# Altium schematic sheet cgd_rif.schdoc
size A3; Organization: Develer s.r.l.; Address1: via Mugellese 1/A; Address2: 50019 Campi Bisenzio; Address3: Firenze; Address4: ITALY; Revision: A; SheetNumber: 1; SheetTotal: 1
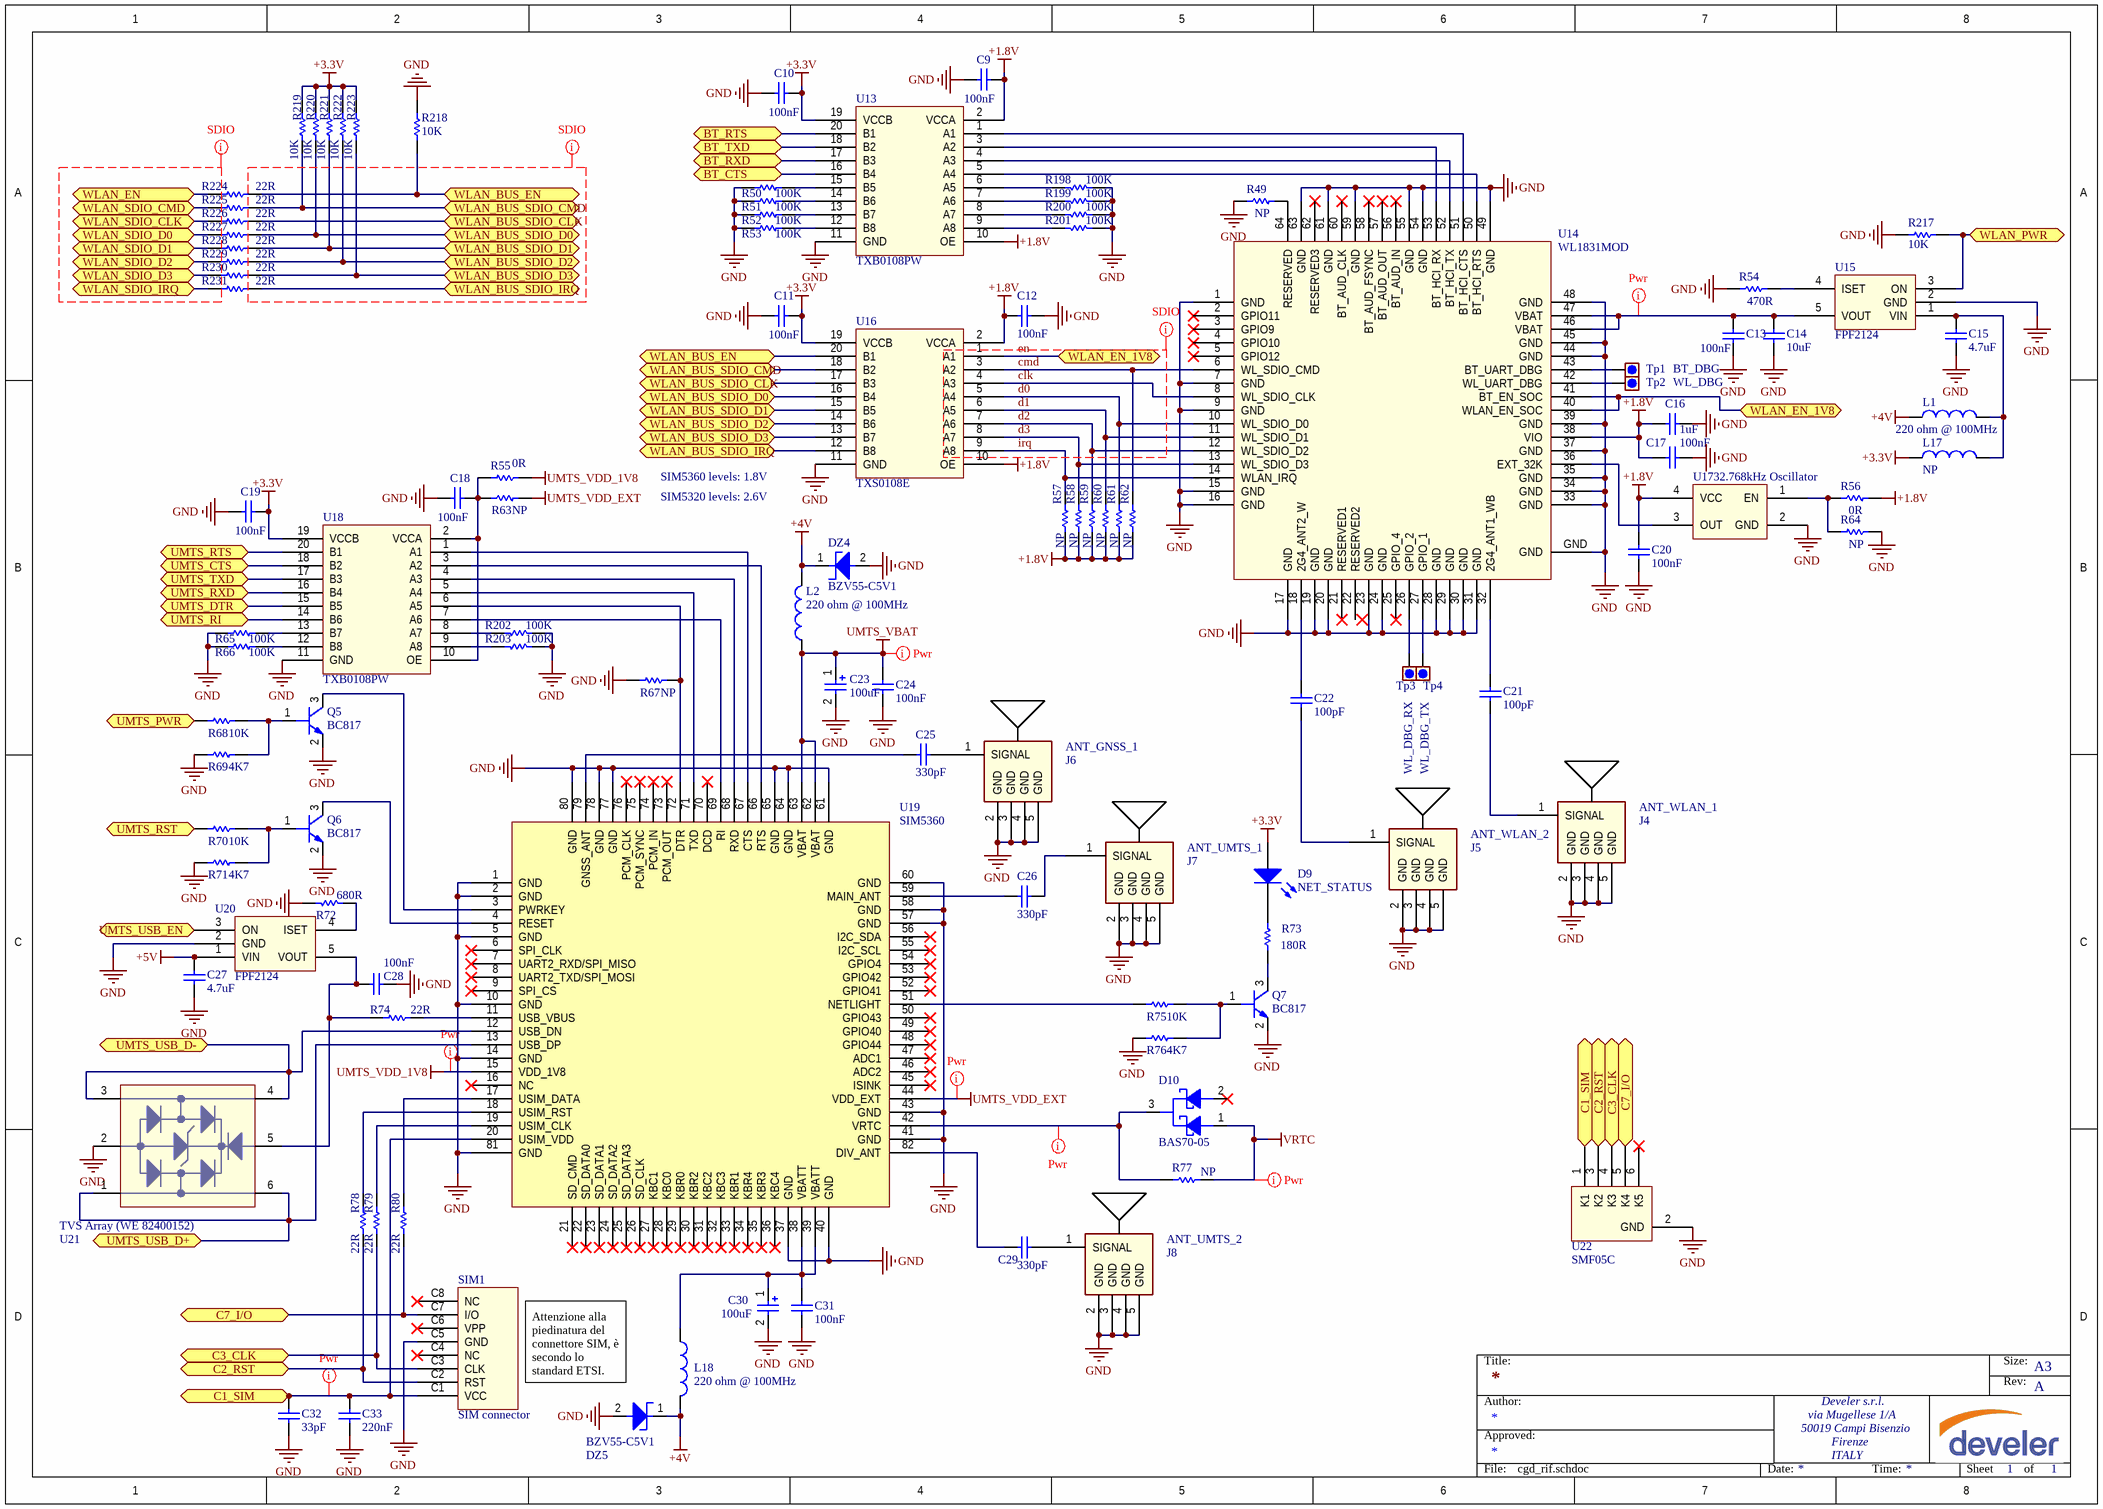
[diagram p0: cgd_rif.schdoc]

## Parts
C9  100nF  [0603_[1608]]
C10  100nF  [0603_[1608]]
C11  100nF  [0603_[1608]]
C12  100nF  [0603_[1608]]
C13  100nF  [0603_[1608]]
C14  10uF  [1206_[3216]]
C15  4.7uF  [0805_[2012]]
C16  1uF  [1206_[3216]]
C17  100nF  [0603_[1608]]
C18  100nF  [0603_[1608]]
C19  100nF  [0603_[1608]]
C20  100nF  [0603_[1608]]
C21  100pF  [0603_[1608]]
C22  100pF  [0603_[1608]]
C23  100uF  [CAP_6x6_D8_SMD]
C24  100nF  [0603_[1608]]
C25  330pF  [0603_[1608]]
C26  330pF  [0603_[1608]]
C27  4.7uF  [0805_[2012]]
C28  100nF  [0603_[1608]]
C29  330pF  [0603_[1608]]
C30  100uF  [CAP_6x6_D8_SMD]
C31  100nF  [0603_[1608]]
C32  33pF  [0603_[1608]]
C33  220nF  [0603_[1608]]
D9  NET_STATUS  [0603_[1608]_LED]
D10  BAS70-05  [SOT-23]
DZ4  BZV55-C5V1  [SOD-80C]
DZ5  BZV55-C5V1  [SOD-80C]
J4  ANT_WLAN_1  [MMCX_SMD_VERTICAL]
J5  ANT_WLAN_2  [MMCX_SMD_VERTICAL]
J6  ANT_GNSS_1  [MMCX_SMD_VERTICAL]
J7  ANT_UMTS_1  [MMCX_SMD_VERTICAL]
J8  ANT_UMTS_2  [MMCX_SMD_VERTICAL]
L1  220 ohm @ 100MHz  [0805_[2012]]
L2  220 ohm @ 100MHz  [0805_[2012]]
L17  NP  [0805_[2012]]
L18  220 ohm @ 100MHz  [0805_[2012]]
Q5  BC817  [SOT-23]
Q6  BC817  [SOT-23]
Q7  BC817  [SOT-23]
R49  NP  [0603_[1608]]
R50  100K  [0603_[1608]]
R51  100K  [0603_[1608]]
R52  100K  [0603_[1608]]
R53  100K  [0603_[1608]]
R54  470R  [0603_[1608]]
R55  0R  [0603_[1608]]
R56  0R  [0603_[1608]]
R57  NP  [0603_[1608]]
R58  NP  [0603_[1608]]
R59  NP  [0603_[1608]]
R60  NP  [0603_[1608]]
R61  NP  [0603_[1608]]
R62  NP  [0603_[1608]]
R63  NP  [0603_[1608]]
R64  NP  [0603_[1608]]
R65  100K  [0603_[1608]]
R66  100K  [0603_[1608]]
R67  NP  [0603_[1608]]
R68  10K  [0603_[1608]]
R69  4K7  [0603_[1608]]
R70  10K  [0603_[1608]]
R71  4K7  [0603_[1608]]
R72  680R  [0603_[1608]]
R73  180R  [0603_[1608]]
R74  22R  [0603_[1608]]
R75  10K  [0603_[1608]]
R76  4K7  [0603_[1608]]
R77  NP  [0603_[1608]]
R78  22R  [0603_[1608]]
R79  22R  [0603_[1608]]
R80  22R  [0603_[1608]]
R198  100K  [0603_[1608]]
R199  100K  [0603_[1608]]
R200  100K  [0603_[1608]]
R201  100K  [0603_[1608]]
R202  100K  [0603_[1608]]
R203  100K  [0603_[1608]]
R217  10K  [0603_[1608]]
R218  10K  [0603_[1608]]
R219  10K  [0603_[1608]]
R220  10K  [0603_[1608]]
R221  10K  [0603_[1608]]
R222  10K  [0603_[1608]]
R223  10K  [0603_[1608]]
R224  22R  [0603_[1608]]
R225  22R  [0603_[1608]]
R226  22R  [0603_[1608]]
R227  22R  [0603_[1608]]
R228  22R  [0603_[1608]]
R229  22R  [0603_[1608]]
R230  22R  [0603_[1608]]
R231  22R  [0603_[1608]]
SIM1  SIM connector  [sim_holder]
Tp1  BT_DBG  [TEST_POINT_THD_D1.6MM]  (no BOM)
Tp2  WL_DBG  [TEST_POINT_THD_D1.6MM]  (no BOM)
Tp3  WL_DBG_RX  [TEST_POINT_THD_D1.6MM]  (no BOM)
Tp4  WL_DBG_TX  [TEST_POINT_THD_D1.6MM]  (no BOM)
U13  TXB0108PW  [TSOP65P640X120-20L]
U14  WL1831MOD  [WL18XX_E-13.4X13.3-N100_0.75]
U15  FPF2124  [SOT-23-5]
U16  TXS0108E  [TSOP65P640X120-20L]
U17  32.768kHz Oscillator  [CRYSTAL_3.2X1.5MM_4P_SMD]
U18  TXB0108PW  [TSOP65P640X120-20L]
U19  SIM5360  [Sim5360]
U20  FPF2124  [SOT-23-5]
U21  TVS Array (WE 82400152)  [SOT-563]
U22  SMF05C  [SC70-6]

## Ports
BT_CTS, BT_RTS, BT_RXD, BT_TXD, C1_SIM, C2_RST, C3_CLK, C7_I/O, UMTS_CTS, UMTS_DTR, UMTS_PWR, UMTS_RI, UMTS_RST, UMTS_RTS, UMTS_RXD, UMTS_TXD, UMTS_USB_D+, UMTS_USB_D-, UMTS_USB_EN, WLAN_BUS_EN, WLAN_BUS_SDIO_CLK, WLAN_BUS_SDIO_CMD, WLAN_BUS_SDIO_D0, WLAN_BUS_SDIO_D1, WLAN_BUS_SDIO_D2, WLAN_BUS_SDIO_D3, WLAN_BUS_SDIO_IRQ, WLAN_EN, WLAN_EN_1V8, WLAN_PWR, WLAN_SDIO_CLK, WLAN_SDIO_CMD, WLAN_SDIO_D0, WLAN_SDIO_D1, WLAN_SDIO_D2, WLAN_SDIO_D3, WLAN_SDIO_IRQ

## Nets
+1.8V: C9.2 C12.2 C16.2 C17.2 C20.2 R56.1 R57.1 R58.1 R59.1 R60.1 R61.1 R62.1 U13.2(VCCA) U13.10(OE) U14.38(VIO) U16.2(VCCA) U16.10(OE) U17.4(VCC)
+3.3V: C10.2 C11.2 C19.2 D9.1(A) L17.2 R219.1 R220.1 R221.1 R222.1 R223.1 U13.19(VCCB) U16.19(VCCB) U18.19(VCCB)
+4V: DZ4.1 DZ5.1 L1.2 L2.1 L18.1
+5V: C27.2 U20.1(VIN)
GND: C9.1 C10.1 C11.1 C12.1 C13.1 C14.1 C15.1 C16.1 C17.1 C18.1 C19.1 C20.1 C23.2 C24.1 C27.1 C28.1 C30.2 C31.1 C32.1 C33.1 DZ4.2 DZ5.2 J4.2(GND) J4.3(GND) J4.4(GND) J4.5(GND) J5.2(GND) J5.3(GND) J5.4(GND) J5.5(GND) J6.2(GND) J6.3(GND) J6.4(GND) J6.5(GND) J7.2(GND) J7.3(GND) J7.4(GND) J7.5(GND) J8.2(GND) J8.3(GND) J8.4(GND) J8.5(GND) Q5.2(E) Q6.2(E) Q7.2(E) R49.2 R50.2 R51.2 R52.2 R53.2 R54.2 R64.1 R65.2 R66.2 R67.2 R69.2 R71.2 R72.2 R76.2 R198.2 R199.2 R200.2 R201.2 R202.2 R203.2 R217.1 R218.1 SIM1.C5(GND) U13.11(GND) U14.1(GND) U14.7(GND) U14.9(GND) U14.15(GND) U14.16(GND) U14.17(GND) U14.19(GND) U14.20(GND) U14.23(GND) U14.24(GND) U14.28(GND) U14.29(GND) U14.30(GND) U14.31(GND) U14.33(GND) U14.34(GND) U14.35(GND) U14.37(GND) U14.39(GND) U14.44(GND) U14.45(GND) U14.48(GND) U14.49(GND) U14.54(GND) U14.55(GND) U14.59(GND) U14.61(GND) U14.63(GND) U14.GND U15.2(GND) U16.11(GND) U17.2(GND) U18.11(GND) U19.1(GND) U19.2(GND) U19.5(GND) U19.10(GND) U19.14(GND) U19.37(GND) U19.40(GND) U19.41(GND) U19.43(GND) U19.57(GND) U19.58(GND) U19.60(GND) U19.61(GND) U19.64(GND) U19.65(GND) U19.77(GND) U19.78(GND) U19.80(GND) U19.81(GND) U20.2(GND) U21.2 U22.2(GND)
UMTS_VBAT: C23.1 C24.2 L2.2 U19.62(VBAT) U19.63(VBAT)
UMTS_VDD_1V8: R55.1 U19.15(VDD_1V8)
UMTS_VDD_EXT: R63.1 U19.44(VDD_EXT)
VRTC: D10.1 R77.1
BT_CTS: U13.16(B4) ; port BT_CTS
BT_RTS: U13.20(B1) ; port BT_RTS
BT_RXD: U13.17(B3) ; port BT_RXD
BT_TXD: U13.18(B2) ; port BT_TXD
C1_SIM: C32.2 C33.2 SIM1.C1(VCC) U19.20(USIM_VDD) U22.1(K1) ; port C1_SIM
C2_RST: R78.2 SIM1.C2(RST) U22.3(K2) ; port C2_RST
C3_CLK: R79.2 SIM1.C3(CLK) U22.4(K3) ; port C3_CLK
C7_I/O: R80.2 SIM1.C7(I/O) U22.5(K4) ; port C7_I/O
clk: U14.8(WL_SDIO_CLK) U16.4(A3)
cmd: R62.2 U14.6(WL_SDIO_CMD) U16.3(A2)
d0: R61.2 U14.10(WL_SDIO_D0) U16.5(A4)
d1: R60.2 U14.11(WL_SDIO_D1) U16.6(A5)
d2: R59.2 U14.12(WL_SDIO_D2) U16.7(A6)
d3: R58.2 U14.13(WL_SDIO_D3) U16.8(A7)
en: U14.40(WLAN_EN_SOC) U14.41(BT_EN_SOC) U16.1(A1) ; port WLAN_EN_1V8
irq: R57.2 U14.14(WLAN_IRQ) U16.9(A8)
UMTS_CTS: U18.18(B2) ; port UMTS_CTS
UMTS_DTR: U18.15(B5) ; port UMTS_DTR
UMTS_PWR: R68.2 ; port UMTS_PWR
UMTS_RI: U18.14(B6) ; port UMTS_RI
UMTS_RST: R70.2 ; port UMTS_RST
UMTS_RTS: U18.20(B1) ; port UMTS_RTS
UMTS_RXD: U18.16(B4) ; port UMTS_RXD
UMTS_TXD: U18.17(B3) ; port UMTS_TXD
UMTS_USB_D+: U19.13(USB_DP) U21.1 U21.6 ; port UMTS_USB_D+
UMTS_USB_D-: U19.12(USB_DN) U21.3 U21.4 ; port UMTS_USB_D-
UMTS_USB_EN: U20.3(ON) ; port UMTS_USB_EN
WLAN_BUS_EN: R218.2 R224.1 U16.20(B1) ; port WLAN_BUS_EN
WLAN_BUS_SDIO_CLK: R226.1 U16.17(B3) ; port WLAN_BUS_SDIO_CLK
WLAN_BUS_SDIO_CMD: R219.2 R225.1 U16.18(B2) ; port WLAN_BUS_SDIO_CMD
WLAN_BUS_SDIO_D0: R220.2 R227.1 U16.16(B4) ; port WLAN_BUS_SDIO_D0
WLAN_BUS_SDIO_D1: R221.2 R228.1 U16.15(B5) ; port WLAN_BUS_SDIO_D1
WLAN_BUS_SDIO_D2: R222.2 R229.1 U16.14(B6) ; port WLAN_BUS_SDIO_D2
WLAN_BUS_SDIO_D3: R223.2 R230.1 U16.13(B7) ; port WLAN_BUS_SDIO_D3
WLAN_BUS_SDIO_IRQ: R231.1 U16.12(B8) ; port WLAN_BUS_SDIO_IRQ
WLAN_EN: R224.2 ; port WLAN_EN
WLAN_PWR: R217.2 U15.3(ON) ; port WLAN_PWR
WLAN_SDIO_CLK: R226.2 ; port WLAN_SDIO_CLK
WLAN_SDIO_CMD: R225.2 ; port WLAN_SDIO_CMD
WLAN_SDIO_D0: R227.2 ; port WLAN_SDIO_D0
WLAN_SDIO_D1: R228.2 ; port WLAN_SDIO_D1
WLAN_SDIO_D2: R229.2 ; port WLAN_SDIO_D2
WLAN_SDIO_D3: R230.2 ; port WLAN_SDIO_D3
WLAN_SDIO_IRQ: R231.2 ; port WLAN_SDIO_IRQ
NetC13_2: C13.2 C14.2 U14.46(VBAT) U14.47(VBAT) U15.5(VOUT)
NetC15_2: C15.2 L1.1 L17.1 U15.1(VIN)
NetC18_2: C18.2 R55.2 R63.2 U18.2(VCCA) U18.10(OE)
NetC21_1: C21.1 U14.32(2G4_ANT1_WB)
NetC21_2: C21.2 J4.1(SIGNAL)
NetC22_1: C22.1 U14.18(2G4_ANT2_W)
NetC22_2: C22.2 J5.1(SIGNAL)
NetC25_1: C25.1 U19.79(GNSS_ANT)
NetC25_2: C25.2 J6.1(SIGNAL)
NetC26_1: C26.1 U19.59(MAIN_ANT)
NetC26_2: C26.2 J7.1(SIGNAL)
NetC28_2: C28.2 R74.2 U20.5(VOUT) U21.5
NetC29_1: C29.1 U19.82(DIV_ANT)
NetC29_2: C29.2 J8.1(SIGNAL)
NetC30_1: C30.1 C31.2 L18.2 U19.38(VBATT) U19.39(VBATT)
NetD9_2: D9.2(K) R73.2
NetD10_3: D10.3 R77.2 U19.42(VRTC)
NetQ5_1: Q5.1(B) R68.1 R69.1
NetQ5_3: Q5.3(C) U19.3(PWRKEY)
NetQ6_1: Q6.1(B) R70.1 R71.1
NetQ6_3: Q6.3(C) U19.4(RESET)
NetQ7_1: Q7.1(B) R75.1 R76.1
NetQ7_3: Q7.3(C) R73.1
NetR49_1: R49.1 U14.64(RESERVED)
NetR50_1: R50.1 U13.15(B5)
NetR51_1: R51.1 U13.14(B6)
NetR52_1: R52.1 U13.13(B7)
NetR53_1: R53.1 U13.12(B8)
NetR54_1: R54.1 U15.4(ISET)
NetR56_2: R56.2 R64.2 U17.1(EN)
NetR65_1: R65.1 U18.13(B7)
NetR66_1: R66.1 U18.12(B8)
NetR67_1: R67.1 U18.6(A5) U19.72(DTR)
NetR72_1: R72.1 U20.4(ISET)
NetR74_1: R74.1 U19.11(USB_VBUS)
NetR75_2: R75.2 U19.51(NETLIGHT)
NetR78_1: R78.1 U19.18(USIM_RST)
NetR79_1: R79.1 U19.19(USIM_CLK)
NetR80_1: R80.1 U19.17(USIM_DATA)
NetR198_1: R198.1 U13.6(A5)
NetR199_1: R199.1 U13.7(A6)
NetR200_1: R200.1 U13.8(A7)
NetR201_1: R201.1 U13.9(A8)
NetR202_1: R202.1 U18.8(A7)
NetR203_1: R203.1 U18.9(A8)
NetTp1_1: Tp1.1 U14.43(BT_UART_DBG)
NetTp2_1: Tp2.1 U14.42(WL_UART_DBG)
NetTp3_1: Tp3.1 U14.26(GPIO_2)
NetTp4_1: Tp4.1 U14.27(GPIO_1)
NetU13_1: U13.1(A1) U14.51(BT_HCI_CTS)
NetU13_3: U13.3(A2) U14.53(BT_HCI_RX)
NetU13_4: U13.4(A3) U14.52(BT_HCI_TX)
NetU13_5: U13.5(A4) U14.50(BT_HCI_RTS)
NetU14_36: U14.36(EXT_32K) U17.3(OUT)
NetU18_1: U18.1(A1) U19.67(CTS)
NetU18_3: U18.3(A2) U19.66(RTS)
NetU18_4: U18.4(A3) U19.68(RXD)
NetU18_5: U18.5(A4) U19.71(TXD)
NetU18_7: U18.7(A6) U19.69(RI)

Not connected (* = marked no-connect by the designer): D10 2*; SIM1 C4(NC)* C6(VPP)* C8(NC)*; U14 2(GPIO11)* 3(GPIO9)* 4(GPIO10)* 5(GPIO12)* 21(RESERVED1)* 22(RESERVED2) 25(GPIO_4)* 56(BT_AUD_IN)* 57(BT_AUD_OUT)* 58(BT_AUD_FSYNC)* 60(BT_AUD_CLK)* 62(RESERVED3)*; U19 6(SPI_CLK)* 7(UART2_RXD/SPI_MISO)* 8(UART2_TXD/SPI_MOSI)* 9(SPI_CS)* 16(NC)* 21(SD_CMD)* 22(SD_DATA0)* 23(SD_DATA1)* 24(SD_DATA2)* 25(SD_DATA3)* 26(SD_CLK)* 27(KBC1)* 28(KBC0)* 29(KBR0)* 30(KBR2)* 31(KBC2)* 32(KBC3)* 33(KBR1)* 34(KBR4)* 35(KBR3)* 36(KBC4)* 45(ISINK)* 46(ADC2)* 47(ADC1)* 48(GPIO44)* 49(GPIO40)* 50(GPIO43)* 52(GPIO41)* 53(GPIO42)* 54(GPIO4)* 55(I2C_SCL)* 56(I2C_SDA)* 70(DCD)* 73(PCM_OUT)* 74(PCM_IN)* 75(PCM_SYNC)* 76(PCM_CLK)*; U22 6(K5)*

## Layout directives
net class Power: C1_SIM, NetC13_2, NetD10_3, UMTS_VBAT, UMTS_VDD_1V8, UMTS_VDD_EXT, VRTC
net class SDIO_BUS: (no net found under the mark)
net class SDIO: (no net found under the mark)
net class SDIO_1V8: clk, cmd, d0, d1, d2, d3, en, irq

## Notes on the sheet
- SIM5360 levels: 1.8V
- SIM5320 levels: 2.6V
- Attenzione alla piedinatura del connettore SIM, è secondo lo standard ETSI.
- Title:
- Size:
- Rev:
- A3
- Author:
- Approved:
- File:
- Date:
- Time:
- Sheet
- of

## Library data of the parts
C9-C13 C16-C20 C24 C28 C31 C33 = Cap: Ceramic X7R 50V; Value: 10nF; Published: 8-Jun-2000; Revision: July-2002: Re-released for DXP Platform.; Publisher: Altium Limited
C14 = Cap: Ceramic X5R 25V; Value: 10nF; Published: 8-Jun-2000; Revision: July-2002: Re-released for DXP Platform.; Publisher: Altium Limited
C15 C27 = Cap: Ceramic X7R 10V; Value: 10nF; Published: 8-Jun-2000; Revision: July-2002: Re-released for DXP Platform.; Publisher: Altium Limited
C21 C22 C25 C26 C29 = Cap: Ceramic COG 50V; Value: 10nF; Published: 8-Jun-2000; Revision: July-2002: Re-released for DXP Platform.; Publisher: Altium Limited
C23 C30 = Cap Pol1: EEEFK1H101P SMT 8x10 50V; Value: 10uF; Published: 8-Jun-2000; Revision: July-2002: Re-released for DXP Platform.; Publisher: Altium Limited
C32 = Cap: Capacitor; Value: 10nF; Published: 8-Jun-2000; Revision: July-2002: Re-released for DXP Platform.; Publisher: Altium Limited
D9 = LED0: LED Green; Published: 8-Jun-2000; LatestRevisionDate: 08-Jul-2005; LatestRevisionNote: Mech Layer 1 removed.; PackageReference: LED-0; Publisher: Altium Limited; PackageDescription: LED; 2 Leads
D10 = BAS70-05: Schottky Barrier Double Diodes; Part Number: NXP BAS70-05; Purchase Code: RS 484-4955
DZ4 DZ5 = Zener
J4-J8 = ANTENNA: MMCX, STRAIGHT JACK, 50OHM (MOLEX 73415-2061)
L1 L2 L17 L18 = Inductor: WE 742792022
Q5-Q7 = BC817: BJT Transistor
R49-R72 R74-R80 R198-R203 R217-R231 = Res1: Resistor; Value: 1K; Published: 8-Jun-2000; Revision: July-2002: Re-released for DXP Platform.; Publisher: Altium Limited
R73 = Res1: Resistor; Revision: July-2002: Re-released for DXP Platform.
SIM1 = SIM WE 693012040811
Tp1-Tp4 = Test_point: Test point
U13 U16 U18 = TXB0108PW: 8-bit bidirectional level translator
U17 = Si501/2/3_32768Hz: 32.768kHz Oscillator (EPSON  X1B0002110001 SG-3030CM)
U19 = SIM5360: SIMCom UMTS/GNSS modem
U21 = TVS_Diode_Array
U22 = SMF05C: TVS diode array